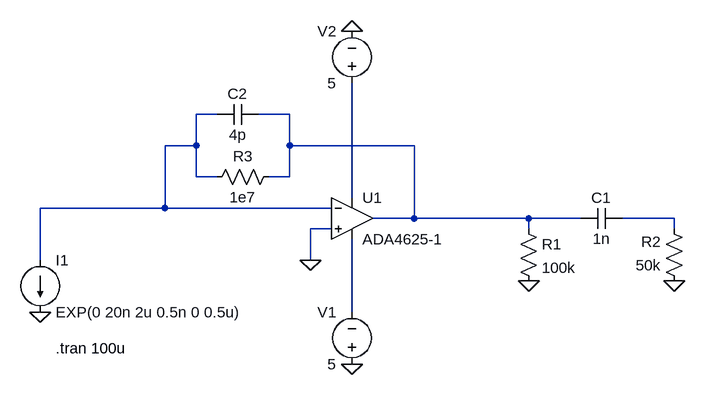
[diagram p0: schematic chargeAmplifier.asc]
chargeAmplifier.asc, the LTspice schematic file:
Version 4
SHEET 1 880 680
WIRE 0 0 -32 0
WIRE 112 0 64 0
WIRE -32 48 -32 0
WIRE -32 48 -80 48
WIRE 112 48 112 0
WIRE 304 48 112 48
WIRE -32 96 -32 48
WIRE 0 96 -32 96
WIRE 112 96 112 48
WIRE 112 96 80 96
WIRE 208 128 208 -48
WIRE -80 144 -80 48
WIRE -80 144 -272 144
WIRE 176 144 -80 144
WIRE 304 160 304 48
WIRE 304 160 240 160
WIRE 480 160 304 160
WIRE 560 160 480 160
WIRE 704 160 624 160
WIRE 176 176 144 176
WIRE 480 176 480 160
WIRE 704 176 704 160
WIRE -272 224 -272 144
WIRE 144 224 144 176
WIRE 208 304 208 192
FLAG 144 224 0
FLAG 208 -128 0
FLAG 208 384 0
FLAG 480 256 0
FLAG 704 256 0
FLAG -272 304 0
SYMBOL Opamps\\ADA4625-1 208 96 R0
SYMATTR InstName U1
SYMBOL voltage 208 400 R180
WINDOW 0 24 96 Left 2
WINDOW 3 24 16 Left 2
WINDOW 123 0 0 Left 0
WINDOW 39 0 0 Left 0
SYMATTR InstName V1
SYMATTR Value 5
SYMBOL voltage 208 -32 R180
WINDOW 0 24 96 Left 2
WINDOW 3 24 16 Left 2
WINDOW 123 0 0 Left 0
WINDOW 39 0 0 Left 0
SYMATTR InstName V2
SYMATTR Value 5
SYMBOL res 464 160 R0
SYMATTR InstName R1
SYMATTR Value 100k
SYMBOL cap 624 144 R90
WINDOW 0 0 32 VBottom 2
WINDOW 3 32 32 VTop 2
SYMATTR InstName C1
SYMATTR Value 1n
SYMBOL res 720 272 R180
WINDOW 0 36 76 Left 2
WINDOW 3 36 40 Left 2
SYMATTR InstName R2
SYMATTR Value 50k
SYMBOL res 96 80 R90
WINDOW 0 0 56 VBottom 2
WINDOW 3 32 56 VTop 2
SYMATTR InstName R3
SYMATTR Value 1e7
SYMBOL cap 64 -16 R90
WINDOW 0 0 32 VBottom 2
WINDOW 3 32 32 VTop 2
SYMATTR InstName C2
SYMATTR Value 4p
SYMBOL current -272 224 R0
WINDOW 123 0 0 Left 0
WINDOW 39 0 0 Left 0
SYMATTR InstName I1
SYMATTR Value EXP(0 20n 2u 0.5n 0 0.5u)
TEXT -248 360 Left 2 !.tran 100u

The netlist it stands for:
* chargeAmplifier.asc
XU1 0 N001 N003 N005 N002 ADA4625-1  ; pins In+ In- V+ V- OUT
V1 0 N005 5
V2 N003 0 5
R1 N002 0 100k
C1 N004 N002 1n
R2 0 N004 50k
R3 N002 N001 1e7
C2 N002 N001 4p
I1 N001 0 EXP(0 20n 2u 0.5n 0 0.5u)
.tran 100u
.backanno
.end